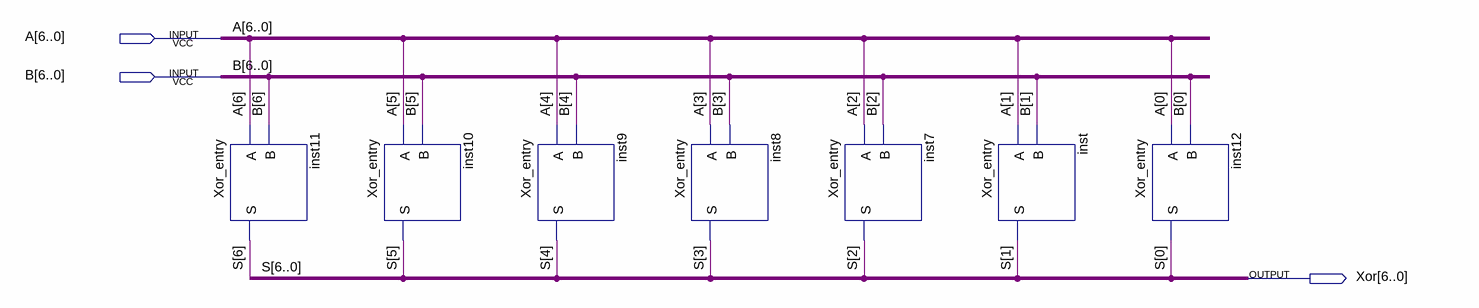
[diagram p0: schematic sheet]
// Quartus schematic Seven_bit_Xor.bdf as structural Verilog: 7 symbols, 3 pins
module Seven_bit_Xor (
  input  [6:0] A,
  input  [6:0] B,
  output [6:0] Xor
);

  Xor_entry inst11 (.A(A[6]), .B(B[6]), .S(Xor[6]));
  Xor_entry inst10 (.A(A[5]), .B(B[5]), .S(Xor[5]));
  Xor_entry inst9 (.A(A[4]), .B(B[4]), .S(Xor[4]));
  Xor_entry inst8 (.A(A[3]), .B(B[3]), .S(Xor[3]));
  Xor_entry inst7 (.A(A[2]), .B(B[2]), .S(Xor[2]));
  Xor_entry inst (.A(A[1]), .B(B[1]), .S(Xor[1]));
  Xor_entry inst12 (.A(A[0]), .B(B[0]), .S(Xor[0]));

  // Other names for the same wires on the sheet: S[6:0] = Xor
endmodule
